# EAGLE design uCurrent (EAGLE 9.5.2)
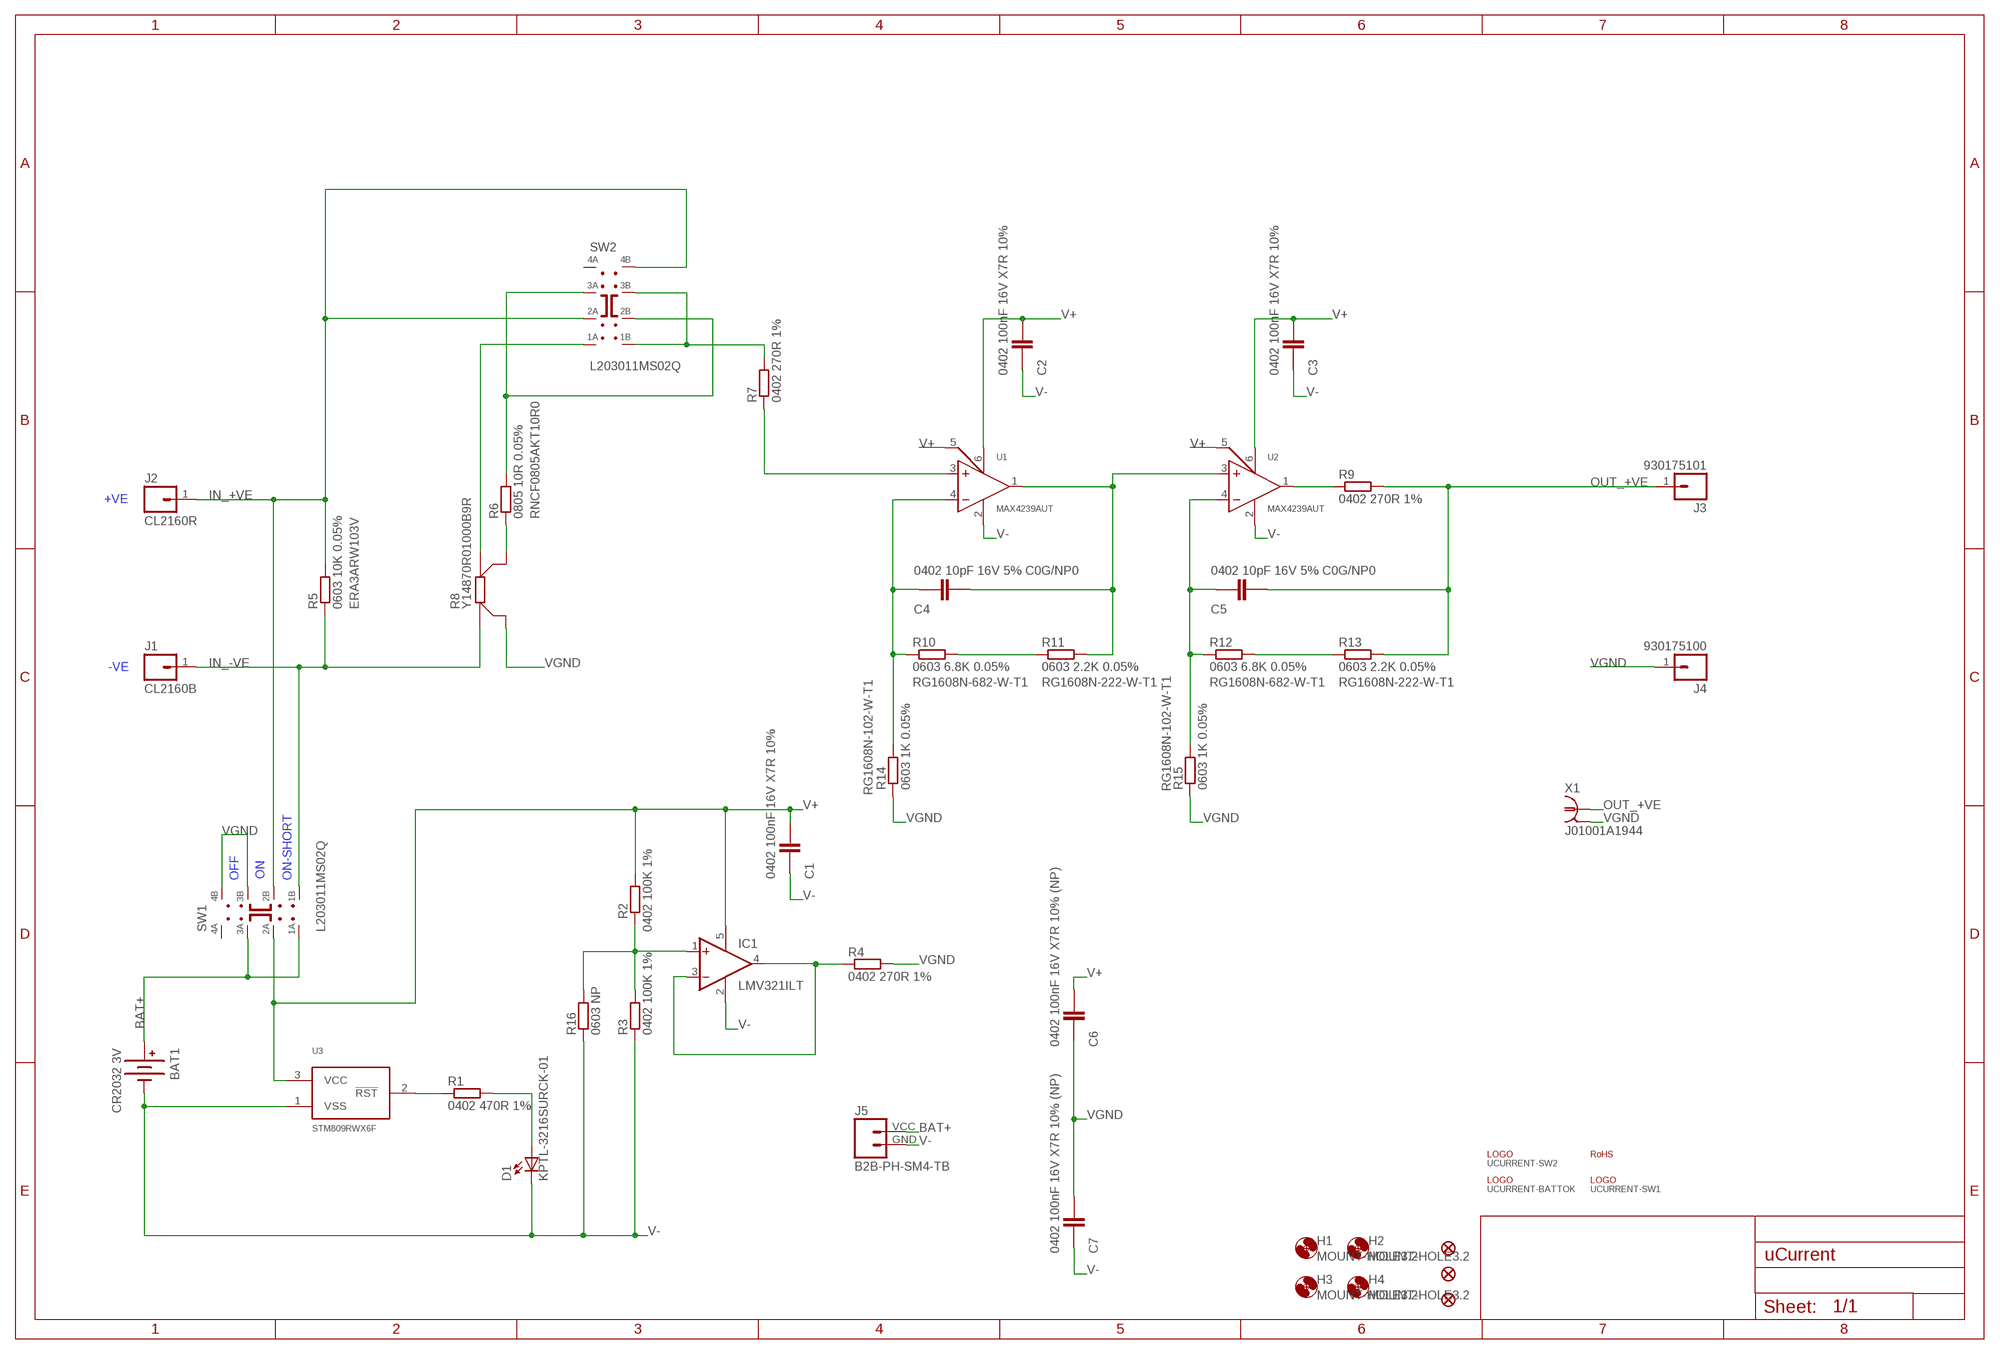
[diagram p0: schematic, sheet 1]

## Parts
BAT1  CR2032 3V  BATTERY-KEYSTONE_1058  [KEYSTONE_1058]
C1  0402 100nF 16V X7R 10%  C-EUC0402-SMALLER  [C0402-SMALLER]
C2  0402 100nF 16V X7R 10%  C-EUC0402-SMALLER  [C0402-SMALLER]
C3  0402 100nF 16V X7R 10%  C-EUC0402-SMALLER  [C0402-SMALLER]
C4  0402 10pF 16V 5% C0G/NP0  C-EUC0402-SMALLER  [C0402-SMALLER]
C5  0402 10pF 16V 5% C0G/NP0  C-EUC0402-SMALLER  [C0402-SMALLER]
C6  0402 100nF 16V X7R 10% (NP)  C-EUC0402-SMALLER  [C0402-SMALLER]
C7  0402 100nF 16V X7R 10% (NP)  C-EUC0402-SMALLER  [C0402-SMALLER]
D1  KPTL-3216SURCK-01  LED-KPTL-3216  [KPTL-3216]
H1  MOUNT-HOLE3.2  [3,2]
H2  MOUNT-HOLE3.2  [3,2]
H3  MOUNT-HOLE3.2  [3,2]
H4  MOUNT-HOLE3.2  [3,2]
IC1  LMV321ILT  LMV321M5X  [SOT23-5]
J1  CL2160B  M01-CL2160R  [CL2160R]
J2  CL2160R  M01-CL2160R  [CL2160R]
J3  930175101  M01-BUG10  [BUG10_SOCKET]
J4  930175100  M01-BUG10  [BUG10_SOCKET]
J5  B2B-PH-SM4-TB  M02-JST-PH-SMD-VERT  [JST-PH-SMD-VERT-02]
JP1  FIDUCIAL1X2.5-STOP  [FIDUCIAL-1X2.5-STOP]
JP2  FIDUCIAL1X2.5-STOP  [FIDUCIAL-1X2.5-STOP]
JP3  FIDUCIAL1X2.5-STOP  [FIDUCIAL-1X2.5-STOP]
L1  UCURRENT-BATTOK  [UCURRENT_BATTOK]
L2  UCURRENT-SW1  [UCURRENT_SW1]
L3  UCURRENT-SW2  [UCURRENT_SW2]
R1  0402 470R 1%  R-EU_R0402-SMALLER  [R0402-SMALLER]
R2  0402 100K 1%  R-EU_R0402-SMALLER  [R0402-SMALLER]
R3  0402 100K 1%  R-EU_R0402-SMALLER  [R0402-SMALLER]
R4  0402 270R 1%  R-EU_R0402-SMALLER  [R0402-SMALLER]
R5  0603 10K 0.05%  R-EU_0603K-SMALL  [C0603K-SMALL]
R6  0805 10R 0.05%  R-EU_R0805  [R0805]
R7  0402 270R 1%  R-EU_R0402-SMALLER  [R0402-SMALLER]
R8  Y14870R01000B9R  R-EU_KELVIN_Y14870R01000B9R  [CSM2512-L]
R9  0402 270R 1%  R-EU_R0402-SMALLER  [R0402-SMALLER]
R10  0603 6.8K 0.05%  R-EU_0603K-SMALL  [C0603K-SMALL]
R11  0603 2.2K 0.05%  R-EU_0603K-SMALL  [C0603K-SMALL]
R12  0603 6.8K 0.05%  R-EU_0603K-SMALL  [C0603K-SMALL]
R13  0603 2.2K 0.05%  R-EU_0603K-SMALL  [C0603K-SMALL]
R14  0603 1K 0.05%  R-EU_0603K-SMALL  [C0603K-SMALL]
R15  0603 1K 0.05%  R-EU_0603K-SMALL  [C0603K-SMALL]
R16  0603 NP  R-EU_0603K-SMALL  [C0603K-SMALL]
SW1  L203011MS02Q  SWITCH-DP3T-L203011MS02Q  [L203011MS02Q]
SW2  L203011MS02Q  SWITCH-DP3T-L203011MS02Q  [L203011MS02Q]
U1  MAX4239AUT  MAX4239  [SOT-23-6]
U2  MAX4239AUT  MAX4239  [SOT-23-6]
U3  STM809RWX6F  [SOT23-3]
U$1  ROHS-1MM  [ROHS-1MM]
X1  J01001A1944  BNC_J01001A1944  [J01001A1944]

## Nets
BAT+ [LVDC]: BAT1.+VE(+) J5.VCC SW1.1 SW1.3
IN_+VE [Signal]: J2.1 R5.2 SW1.6 SW2.2 SW2.8
IN_-VE [Signal]: J1.1 R5.1 R8.I1(A) SW1.5
N$3 [LVDC]: R1.1 U3.2(!RST)
N$4 [Signal]: IC1.1(+IN) R2.1 R3.2 R16.2
N$5 [Signal]: IC1.3(-IN) IC1.4(OUT) R4.1
N$6 [Signal]: R7.2 SW2.5 SW2.7
N$7: R6.1 R8.E2(C)
N$8 [Signal]: R8.I2(D) SW2.1
N$9: R6.2 SW2.3 SW2.6
N$10 [Signal]: R7.1 U1.3
N$11 [Signal]: C4.1 R11.2 U1.1 U2.3
N$12 [Signal]: C4.2 R10.1 R14.2 U1.4
N$13 [Signal]: R10.2 R11.1
N$15 [Signal]: C5.2 R12.1 R15.2 U2.4
N$16 [Signal]: R12.2 R13.1
N$17 [LVDC]: D1.A R1.2
N$19 [Signal]: R9.1 U2.1
OUT_+VE [Signal]: C5.1 J3.1 R9.2 R13.2 X1.1
V+ [LVDC]: C1.1 C2.1 C3.1 C6.1 IC1.5(V+) R2.2 SW1.2 U1.5 U1.6 U2.5 U2.6 U3.3(VCC)
V- [LVDC]: BAT1.-VE(-) C1.2 C2.2 C3.2 C7.2 D1.C IC1.2(V-) J5.GND R3.1 R16.1 U1.2 U2.2 U3.1(VSS)
VGND [LVDC]: C6.2 C7.1 J4.1 R4.2 R8.E1(B) R14.1 R15.1 SW1.7 SW1.8 X1.2 X1.3 X1.4 X1.5
Unconnected: SW1.4 SW2.4

## Notes on the sheet
- +VE
- -VE
- OFF | ON | ON-SHORT

## Library data of the parts
BAT1 = SmartSentry Parts:BATTERY: Battery Holders Various common sizes : AA, AAA, 20mm coin cell and 12mm coin cell.
C1-C7 = SmartSentry Parts:C-EU: CAPACITOR, European symbol
D1 = SmartSentry Parts:LED: LEDs Standard schematic elements and footprints for 5mm, 3mm, 1206, and 0603 sized LEDs. 5mm - Spark Fun Electronics SKU : COM-00529 (and others)
H1-H4 = SmartSentry Holes:MOUNT-HOLE: MOUNTING HOLE with drill center marker
IC1 = linear:LMV321?*: General Purpose, Low Voltage, Rail-to-Rail Output Operational Amplifiers Source: http://www.national.com/mpf/LM/LMV321.html http://www.national.com/dt/lmv_qual.pdf
J1-J4 = SmartSentry Parts:M01
J5 = SmartSentry Parts:M02: Header 2 Standard 2-pin 0.1" header. Use with straight break away headers (SKU : PRT-00116), right angle break away headers (PRT-00553), swiss pins (PRT-00743), machine pins (PRT-00117), and female headers (PRT-00115). Molex polarized connector foot print use with SKU : PRT-08233 with associated crimp pins and housings.
JP1-JP3 = SmartSentry Parts:FIDUCIAL: Fiducial Alignment Points Various fiducial points for machine vision alignment.
L1-L3 = SmartSentry Logos:UCURRENT
R1-R4 R7 R9 R16 = SmartSentry Parts:R-EU_: RESISTOR, European symbol
R5 = SmartSentry Parts:R-EU_: RESISTOR, European symbol; MPN: ERA3ARW103V
R6 = SmartSentry Parts:R-EU_: RESISTOR, European symbol; MPN: RNCF0805AKT10R0
R8 = SmartSentry Parts:R-EU_KELVIN_
R10 R12 = SmartSentry Parts:R-EU_: RESISTOR, European symbol; MPN: RG1608N-682-W-T1
R11 R13 = SmartSentry Parts:R-EU_: RESISTOR, European symbol; MPN: RG1608N-222-W-T1
R14 R15 = SmartSentry Parts:R-EU_: RESISTOR, European symbol; MPN: RG1608N-102-W-T1
SW1 SW2 = SmartSentry Parts:SWITCH-DP3T
U1 U2 = SmartSentry Parts:MAX4239
U3 = SmartSentry Parts:STM809RWX6F
U$1 = SmartSentry Logos:ROHS: RoHS Logo
X1 = SmartSentry Parts:BNC

## Net classes
1 Signal: width 0.25 mm, clearance 0.2 mm
2 LVDC: width 0.3 mm, clearance 0.2 mm
3 VOUT: clearance 1.2 mm

## Board
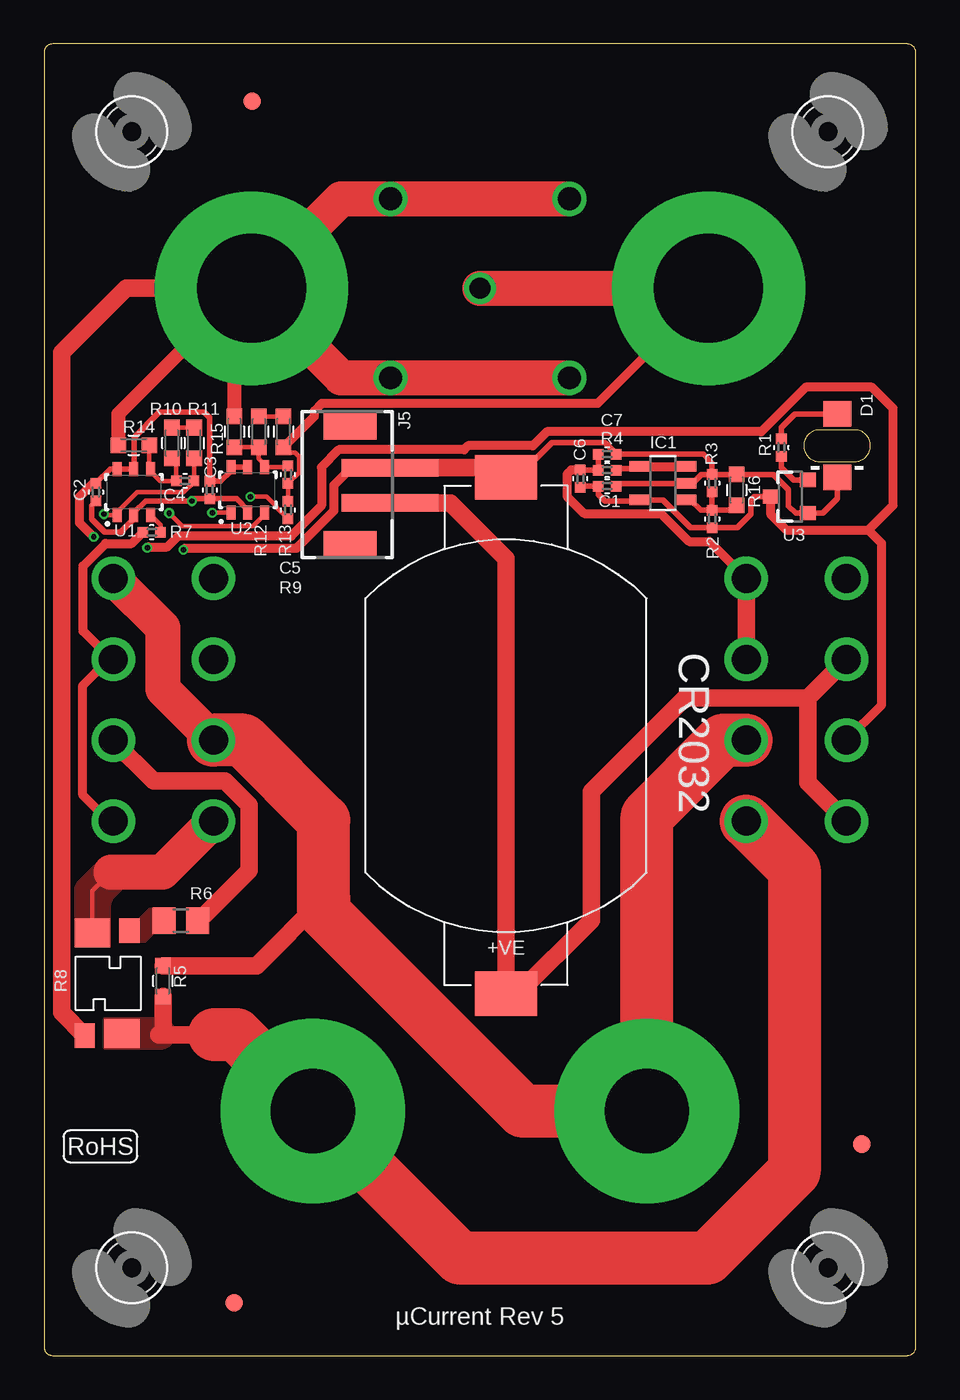
[diagram p1: board, top side]
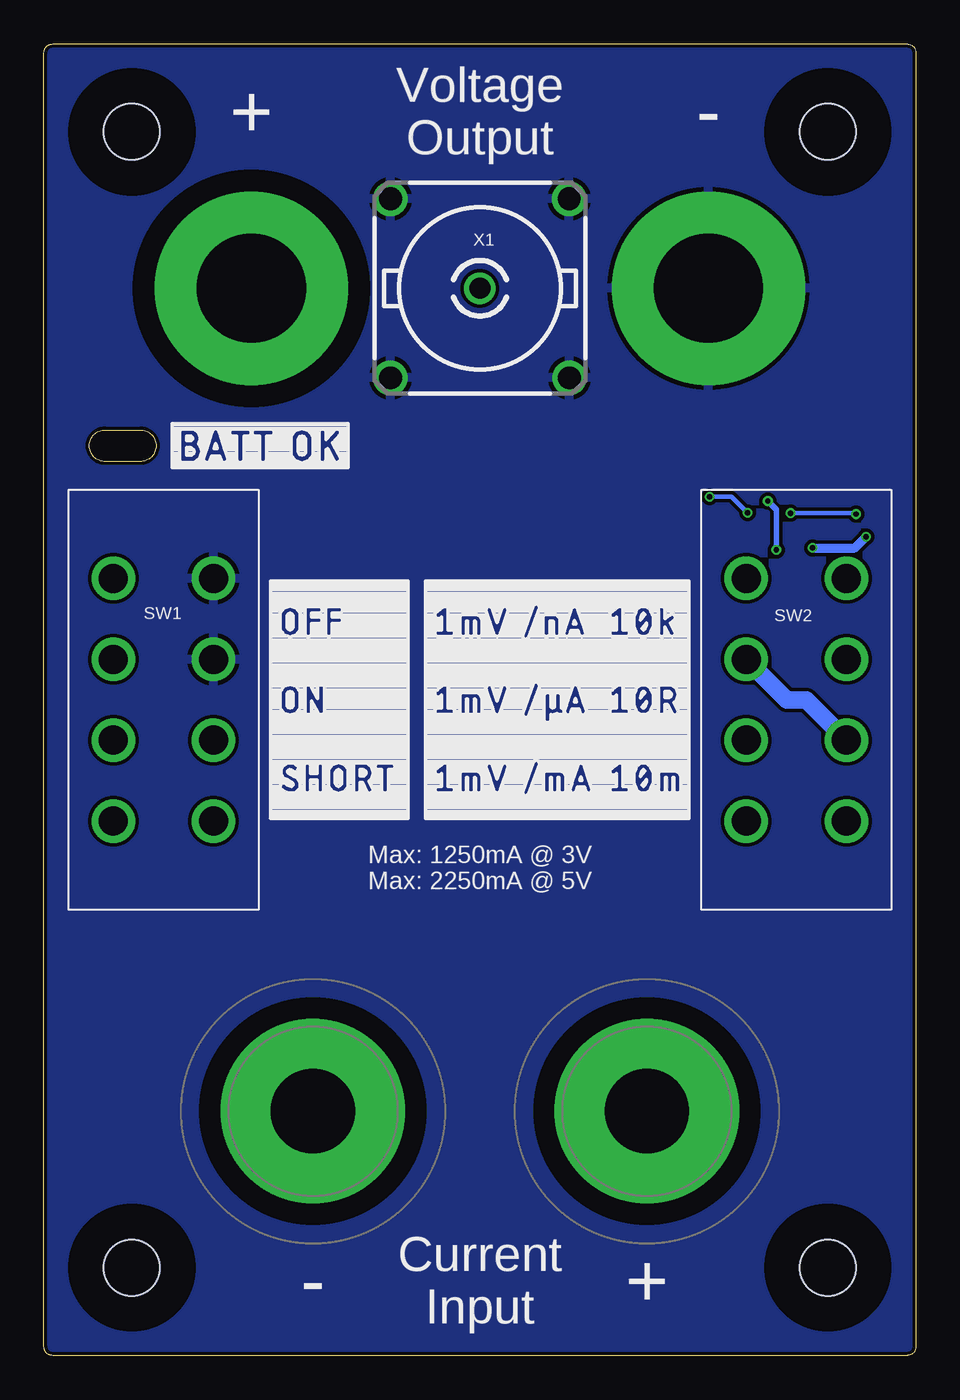
[diagram p2: board, bottom side, seen from below]

Size 49.6 x 74.6 mm. Coordinates in mm from the lower left corner, seen from the top.
Outline: 0,74.1 0,0.5 arc90 0.5,0 49.1,0 arc90 49.6,0.5 49.6,74.1 arc90 49.1,74.6 0.5,74.6 arc90 0,74.1
Copper layers (1*16): Top 0.035mm / dielectric 1mm / Bottom 0.035mm
Design rules "JLCPCB *": minimum track width 0.15mm, minimum drill 0.3mm, track to track 0.15mm, track to pad 0.15mm, pad to pad 0.15mm, via to via 0.15mm, smd to smd 0.15mm, copper to edge 0.2mm, drill to drill 0.15mm, minimum pad ring 10mil, minimum via ring 5mil, stop-mask expansion 4mil, vias tented up to drill 0.6mm, thermal gap 10mil
bRestrict: area 31.6,54.5 to 44,66.8; area 9.4,8 to 21.2,19.8; area 28.4,8 to 40.2,19.8

### Footprints (pad centres in the part's own frame; a part is rotated, then mirrored left to right if it is on the bottom)
KEYSTONE_1058 = smd 2.54 x 3.51: +VE -14.68,0; -VE 14.68,0
C0402-SMALLER = smd 0.6 x 0.6: 1 -0.5,0; 2 0.5,0
KPTL-3216 = smd 1.45 x 1.6: A 1.8,0; C -1.8,0
3,2 = hole 3.2: 0,0
SOT23-5 = smd 0.6 x 1.2: 1 -0.95,-1.306; 2 0,-1.306; 3 0.95,-1.306; 4 0.95,1.306; 5 -0.95,1.306
CL2160R = drill 4.8 pad 10.5: 1 0,0
BUG10_SOCKET = drill 6.2 pad 11: 1 0,0
JST-PH-SMD-VERT-02 = smd 1 x 5.5: GND 1,-2; VCC -1,-2 | smd 1.6 x 3: P$1 -3.4,0.27; P$2 3.4,0.27
FIDUCIAL-1X2.5-STOP = smd 1 x 1: 1 0,0
R0402-SMALLER = smd 0.6 x 0.6: 1 -0.5,0; 2 0.5,0
C0603K-SMALL = smd 0.889 x 0.889: 1 -0.875,0; 2 0.875,0
R0805 = smd 1.3 x 1.5: 1 -0.95,0; 2 0.95,0
CSM2512-L = smd 1.39 x 1.14: E1 -2.985,1.27; E2 2.985,-1.27 | smd 1.65 x 2.01: I1 -2.855,-0.835; I2 2.855,0.835
L203011MS02Q = drill 1.65: 1 -2.85,-6.9; 2 -2.85,-2.3; 3 -2.85,2.3; 4 -2.85,6.9; 5 2.85,-6.9; 6 2.85,-2.3; 7 2.85,2.3; 8 2.85,6.9
SOT-23-6 = smd 0.51 x 0.8: 1 -0.95,-1.3; 2 0,-1.3; 3 0.95,-1.3; 4 0.95,1.3; 5 0,1.3; 6 -0.95,1.3
SOT23-3 = smd 0.9 x 0.8: 1 1,-0.95; 2 1,0.95; 3 -1.1,0
J01001A1944 = drill 1.2: 1 0,0 | drill 1.3: 2 5.08,5.09; 3 -5.09,5.09; 4 -5.09,-5.09; 5 5.09,-5.09

### Placement (x,y rotation side)
BAT1  26.28,35.27 90 top
C1  32.04,49.45 0 top
C2  2.96,49.11 270 top
C3  9.43,49.24 270 top
C4  8.03,49.75 180 top
C5  13.88,50.11 90 top
C6  30.52,49.87 90 top
C7  32.04,51.27 0 top
D1  45.12,51.75 90 top
H1  5,69.6 0 top
H2  44.6,69.6 0 top
H3  5,5 0 top
H4  44.6,5 0 top
IC1  35.21,49.62 90 top
J1  15.3,13.9 0 bottom
J2  34.3,13.9 0 bottom
J3  37.8,60.7 0 bottom
J4  11.8,60.7 0 bottom
J5  17.69,49.49 90 top
JP1  10.83,3.01 0 top
JP2  46.52,12.03 0 top
JP3  11.85,71.34 0 top
L1  42.3,50.5 0 bottom
L2  36.7,30.55 0 bottom
L3  27.9,30.55 0 bottom
R1  41.95,51.65 90 top
R2  38.01,47.59 270 top
R3  38.01,49.62 270 top
R4  32.04,50.36 180 top
R5  6.77,21.3 90 top
R6  7.78,24.73 0 top
R7  6.13,46.82 180 top
R8  3.59,21.17 90 top
R9  13.88,48.09 90 top
R10  7.27,51.91 90 top
R11  8.54,51.91 270 top
R12  12.23,52.54 90 top
R13  13.62,52.54 270 top
R14  5.12,51.78 0 top
R15  10.83,52.54 270 top
R16  39.41,49.24 270 top
SW1  42.8,37.3 0 bottom
SW2  6.8,37.3 0 bottom
U1  5.12,49.11 0 top
U2  11.59,49.24 0 top
U3  42.45,48.86 0 top
U$1  3.21,11.9 0 top
X1  24.8,60.7 0 bottom

### Tracks (layer width: path | path; a pad name or v marks a point on that pad's centre or on a via)
BAT+
  Top 1: 43.45,37.4 SW1.3 | 43.45,37.4 36.47,37.4 31.13,32.07 31.13,24.76 26.96,20.59 BAT1.+VE 26.28,45.34 23.13,48.49 J5.VCC | SW1.1 43.45,32.6 43.45,37.4
IN_+VE
  Top 1: R5.2 12.09,22.17 15.91,26
  Top 2: SW2.2 6.77,37.88 6.77,41.38 SW2.8
  Top 3: SW1.6 38.63,35 34.3,30.67 J2.1 27.25,13.9 15.91,25.23 15.91,26 15.91,30.44 11.35,35 SW2.2
IN_-VE
  Top 1: 9.69,18.25 6.51,18.25 6.77,18.5 R5.1
  Top 3: SW1.5 42.68,27.67 42.68,10.48 37.75,5.55 23.65,5.55 J1.1 10.95,18.25 9.69,18.25
  pour Top (no thermals): 3.46,19.14 6.6,19.14 arc-90 7.4,18.34 7.4,18.29 arc-90 6.6,17.49 3.46,17.49
N$3
  Top 0.3: R1.1 41.95,50.51 42.65,49.81 U3.2
N$4
  Top 0.3: R3.2 R2.1 | IC1.1 36.77,48.67 37.36,48.09 R2.1 | R2.1 39.13,48.09 R16.2
N$5
  Top 0.3: IC1.4 33.78,50.44 32.62,50.44 R4.1
  Top 0.5: IC1.4 IC1.3
N$6
  Top 0.5: SW2.5 3.69,30.4 2.21,31.88 2.21,38.12 3.69,39.6 SW2.7 3.82,39.6 2.22,41.2 2.22,44.91 3.51,46.19 5,46.19 R7.2
N$7
  pour Top (no thermals): 4.35,24.73 5.37,24.73 6,25.36 7.4,25.36 7.4,24.09 6.26,24.09 5.75,23.58 4.35,23.58
N$8
  Top 0.25: 3.81,27.48 2.76,26.43 R8.I2
  Top 2: SW2.1 6.73,27.48 3.81,27.48
  pour Top (no thermals): 1.81,23.33 1.81,26.43 arc-45 2.05,26.99 3.08,28.03 4.48,26.63 3.95,26.1 arc45 3.72,25.54 3.72,23.33 1.94,23.33
N$9
  Top 0.5: 3.95,34.96 SW2.6
  Top 1: 3.95,34.96 6.25,32.67 10.31,32.67 11.66,31.31 11.66,27.59 8.81,24.73 R6.2
  Bottom 1: SW2.3 7.34,37.29 6.24,37.29 SW2.6
N$10
  Top 0.25: U1.3 6.63,47.24 R7.1
N$11  (via drill 0.3)
  Top 0.25: v3.41,47.86 3.45,47.81 U1.1 4.16,47.98 5.29,49.1 7.95,49.1 8.53,49.69 C4.1 8.54,49.76 R11.2 | U2.3 12.54,47.84 11.89,47.19 7.85,47.19 v7.12,47.91
  Bottom 0.25: v3.41,47.86 3.46,47.91 v7.12,47.91
N$12
  Top 0.25: R14.2 5.99,50.49 U1.4 6.07,50.28 6.6,49.75 C4.2 7.53,50.77 R10.1
N$13
  Top 0.25: R10.2 R11.1
N$15
  Top 0.25: R12.1 12.2,51.64 | R15.2 12.18,51.66 12.2,51.64 | 12.2,51.64 12.2,51 12.54,50.66 U2.4 13.81,50.54 C5.2
N$16
  Top 0.25: R12.2 R13.1
N$17
  Top 0.3: R1.2 41.95,52.78 42.73,53.56 D1.A
N$19  (via drill 0.3)
  Top 0.25: U2.1 v9.58,47.94 v9.57,47.93 | v11.74,48.84 12.68,48.84 13.24,48.28 13.24,48.23 R9.1
  Bottom 0.25: v9.57,47.93 10.48,48.84 v11.74,48.84
OUT_+VE
  Top 0.25: R9.2 C5.1 13.9,49.61 14.52,50.23 14.52,51.12 14.28,51.35 13.94,51.35 R13.2
  Top 0.5: J3.1 37.8,60.46 31.5,54.16 15.82,54.16 15.39,53.73 15.39,53.43 R13.2
  Top 2: X1.1 37.56,60.7 37.8,60.46
V+  (via drill 0.3)
  Top 0.3: U2.5 U2.6 10.64,50.32 10.06,49.74 C3.1 9.42,49.76 9.42,53.35 9.11,53.65 6.55,53.65 5.12,52.22 U1.5 U1.6 3.76,50.41 C2.1 | U3.3 40.42,48.86 40.23,48.66 40.23,47.87 39.44,47.09 R2.2 36.78,47.09 35.2,48.67 IC1.5 33.84,48.6 31.91,48.6 31.54,48.98 C1.1 30.59,49.45 C6.1
  Top 0.5: SW1.2 47.66,37.01 47.66,46.19 46.9,46.95 | U3.3 41.35,47.82 42.22,46.95 46.9,46.95 | v5.88,45.94 5.94,46 7.02,46 7.63,46.6 14.06,46.6 15.79,48.33 15.79,50.53 16.77,51.52 23.91,51.52 24.13,51.74 27.82,51.74 28.61,52.54 40.8,52.54 43.34,55.08 47.11,55.08 48.3,53.89 48.3,48.35 46.9,46.95 | v2.83,46.57 2.81,46.57 2.03,47.36 2.03,48.85 2.79,49.61 C2.1
  Bottom 0.5: v5.88,45.94 3.46,45.94 v2.83,46.57
V-  (via drill 0.3)
  Top 0.3: R3.1 37.39,50.12 36.99,49.71 36.62,49.71 IC1.2 36.5,49.59 32.68,49.59 C1.2 | R3.1 R16.1 41.5,50.11 42.36,49.25 42.36,48.32 42.77,47.91 U3.1 44.3,47.91 45.12,48.73 D1.C | R3.1 38.01,50.76 37.5,51.27 C7.2 32.54,51.29 31.9,51.93 28.89,51.93 27.15,50.19 26.28,49.32 BAT1.-VE | C2.2 2.7,48.36 2.7,47.59 3.46,46.82 4.35,46.82 5.12,47.59 U1.2 5.12,47.94 5.78,48.6 v8.42,48.6 8.54,48.73 C3.2 10.95,48.74 11.59,48.09 U2.2
  Top 0.5: J5.GND 17.49,50.49 16.49,49.49 16.49,48.04 14.35,45.9 8.02,45.9 v7.93,45.82
  Top 1: J5.GND 26.85,50.49 27.15,50.19
  Bottom 0.3: v8.42,48.6 7.93,48.12 v7.93,45.82
VGND
  Top 0.3: C7.1 R4.2 31.53,50.37 C6.2
  Top 0.5: C6.2 30,50.37 29.75,50.13 29.75,48.86 30.72,47.89 35.09,47.89 36.69,46.3 37.85,46.3 SW1.8 | 11.37,60.7 J4.1
  Top 0.8: R14.1 4.24,53.57 11.37,60.7 | 10.83,59.73 R15.1
  Top 1: SW1.8 SW1.7 | R8.E1 1,19.51 1,57.03 4.66,60.7 J4.1 10.83,59.73
  Top 2: X1.3 X1.2 16.89,65.79 J4.1 16.89,55.61 X1.5 X1.4
  pour Bottom: 0,74.6 49.6,74.6 49.6,0 0,0

### Text on the board
tPlace: CR2032 | µCurrent Rev 5
bPlace: - | Voltage / Output | + | Max: 1250mA @ 3V / Max: 2250mA @ 5V | + | Current / Input | -
bStop: µCurrent